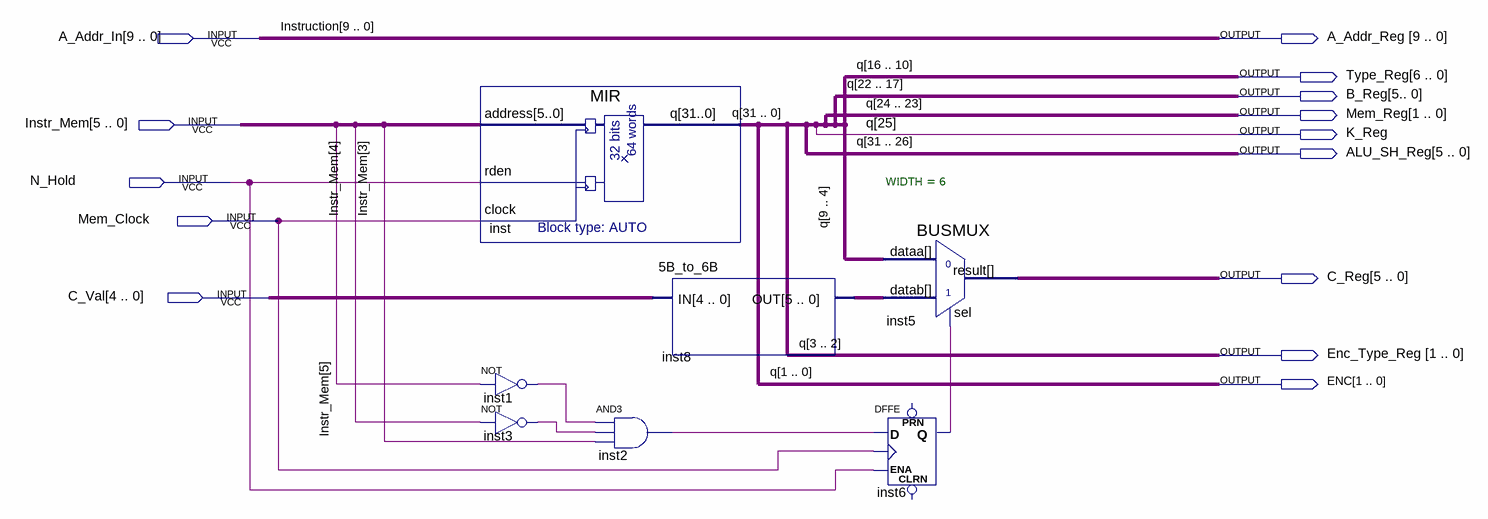
[diagram p0: schematic sheet]
// Quartus schematic MIR_DECODE.bdf as structural Verilog: 7 symbols, 14 pins
module MIR_DECODE (
  input  [9:0] A_Addr_In,
  input  [5:0] Instr_Mem,
  input  N_Hold,
  input  Mem_Clock,
  input  [4:0] C_Val,
  output [9:0] A_Addr_Reg,
  output [6:0] Type_Reg,
  output [5:0] B_Reg,
  output [1:0] Mem_Reg,
  output K_Reg,
  output [5:0] ALU_SH_Reg,
  output [5:0] C_Reg,
  output [1:0] Enc_Type_Reg,
  output [1:0] ENC
);

  wire inst1_out, inst2_out, inst3_out, inst6_q;
  wire [5:0] inst8_out;
  wire [9:4] q;

  MIR inst (
    .address(Instr_Mem), .rden(N_Hold), .clock(Mem_Clock),
    .q({ALU_SH_Reg, K_Reg, Mem_Reg, B_Reg, Type_Reg, q, Enc_Type_Reg, ENC}));
  not inst1 (inst1_out, Instr_Mem[5]);
  not inst3 (inst3_out, Instr_Mem[4]);
  and inst2 (inst2_out, inst1_out, inst3_out, Instr_Mem[3]);
  \5B_to_6B  inst8 (.IN(C_Val), .OUT(inst8_out));
  BUSMUX #(.WIDTH(6)) inst5 (.datab(inst8_out), .sel(inst6_q), .dataa(q), .result(C_Reg));
  DFFE inst6 (.D(inst2_out), .CLK(Mem_Clock), .ENA(N_Hold), .Q(inst6_q));  // open: PRN, CLRN

  assign A_Addr_Reg = A_Addr_In;

  // Other names for the same wires on the sheet: Instruction[9:0] = A_Addr_In;
  //   q (some bits) = {ALU_SH_Reg, K_Reg, Mem_Reg, B_Reg, Type_Reg, Enc_Type_Reg, ENC}
endmodule
